# EAGLE schematic cephal (EAGLE 6.4)
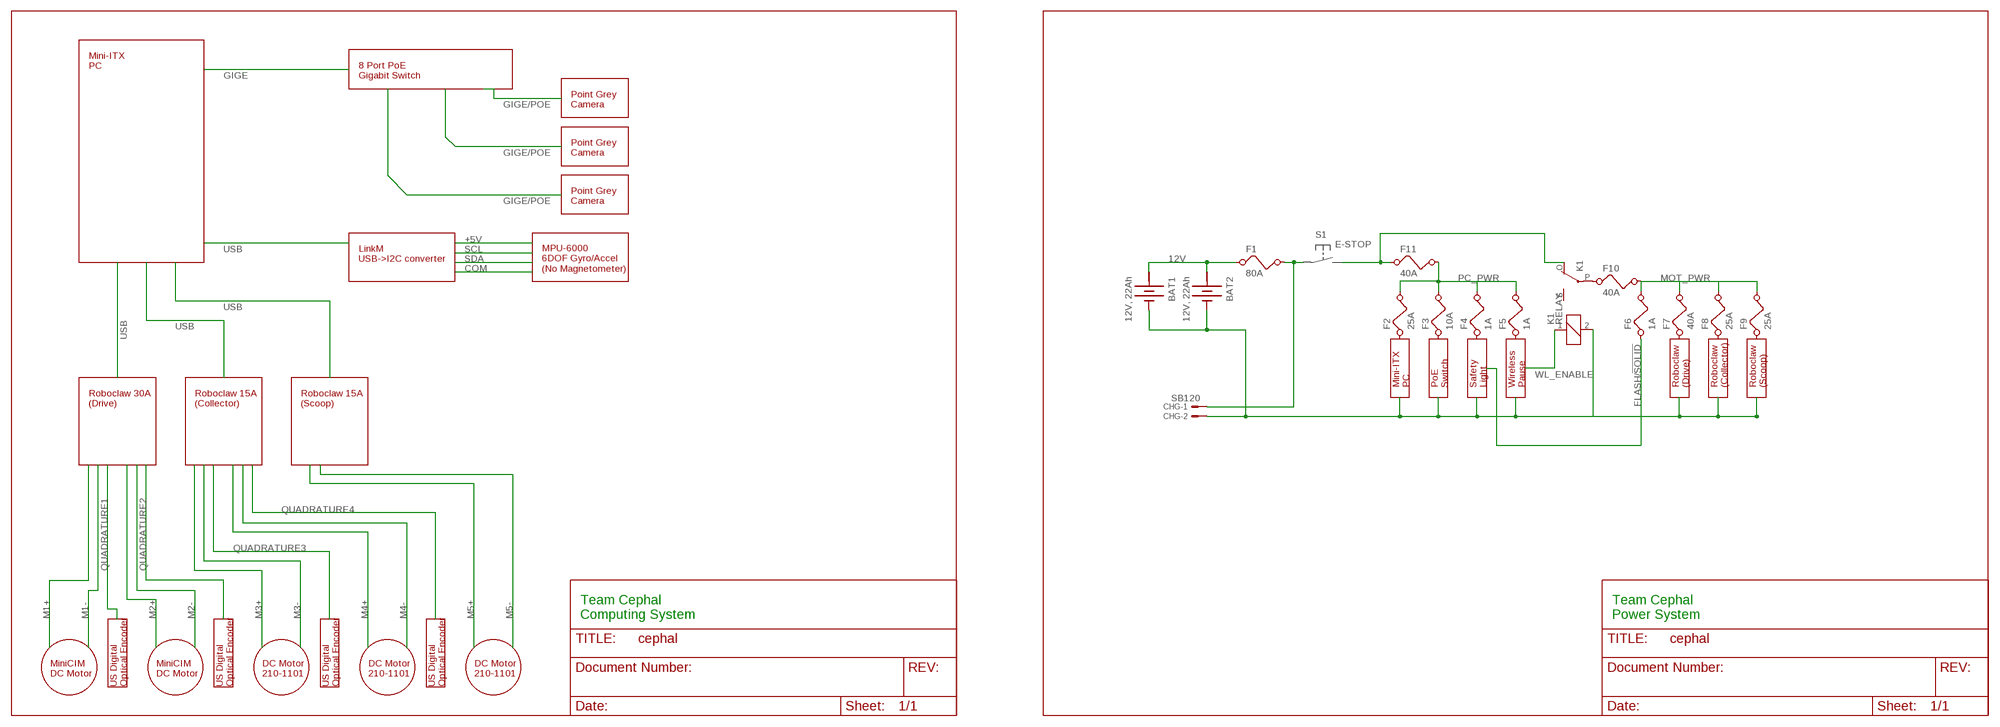
[diagram p0: schematic, sheet 1]

## Parts
BAT1  12V, 22Ah  BATTERY  [BATTERY]
BAT2  12V, 22Ah  BATTERY  [BATTERY]
CHG  SB120  C-GRID-02-70543  [70543-02]
F1  80A  FUSE  [FUSE]
F2  25A  FUSE  [FUSE]
F3  10A  FUSE  [FUSE]
F4  1A  FUSE  [FUSE]
F5  1A  FUSE  [FUSE]
F6  1A  FUSE  [FUSE]
F7  40A  FUSE  [FUSE]
F8  25A  FUSE  [FUSE]
F9  25A  FUSE  [FUSE]
F10  40A  FUSE  [FUSE]
F11  40A  FUSE  [FUSE]
K1  RELAY  G2R  [G2R]

## Nets
12V: BAT1.+ BAT2.+ F1.1
FLASH/!SOLID: F6.1
MOT_PWR: F6.2 F7.2 F8.2 F9.2 F10.2
N$2: BAT1.- BAT2.- CHG.2 K1.2
N$4: F11.1 K1.O(2:O)
N$6: CHG.1 F1.2
N$7: F10.1 K1.P(2:P)
PC_PWR: F2.2 F3.2 F4.2 F5.2 F11.2
WL_ENABLE: K1.1
Unconnected: F2.1 F3.1 F4.1 F5.1 F7.1 F8.1 F9.1 K1.S(2:S)

## Notes on the sheet
- Mini-ITX
  PC
- 8 Port PoE
  Gigabit Switch
- Point Grey
  Camera
- Point Grey
  Camera
- Point Grey
  Camera
- LinkM
  USB->I2C converter
- MPU-6000
  6DOF Gyro/Accel
  (No Magnetometer)
- Mini-ITX
  PC
- PoE
  Switch
- Safety
  Light
- Wireless
  Pause
- Roboclaw
  (Drive)
- Roboclaw
  (Collector)
- Roboclaw
  (Scoop)
- Roboclaw 30A
  (Drive)
- Roboclaw 15A
  (Collector)
- Roboclaw 15A
  (Scoop)
- Team Cephal
  Computing System
- Team Cephal
  Power System
- MiniCIM
  DC Motor
- MiniCIM
  DC Motor
- DC Motor
  210-1101
- DC Motor
  210-1101
- DC Motor
  210-1101
- US Digital
  Optical Encoder
- US Digital
  Optical Encoder
- US Digital
  Optical Encoder
- US Digital
  Optical Encoder

## Power pins joined to a net without a drawn wire
+: BAT1.+@1(+) BAT2.+@1(+)

## Library data of the parts
BAT1 BAT2 = special:BATTERY: BATTERY
CHG = con-molex:C-GRID-02: CONNECTOR wire to board 2.54 mm (0.100") pitch header; OC_FARNELL: unknown; OC_NEWARK: unknown
F1-F11 = special:FUSE: FUSE 5 x 20 mm
K1 = relay:G2R: RELAY 1 x switch, Omron; OC_FARNELL: 1569185; OC_NEWARK: unknown